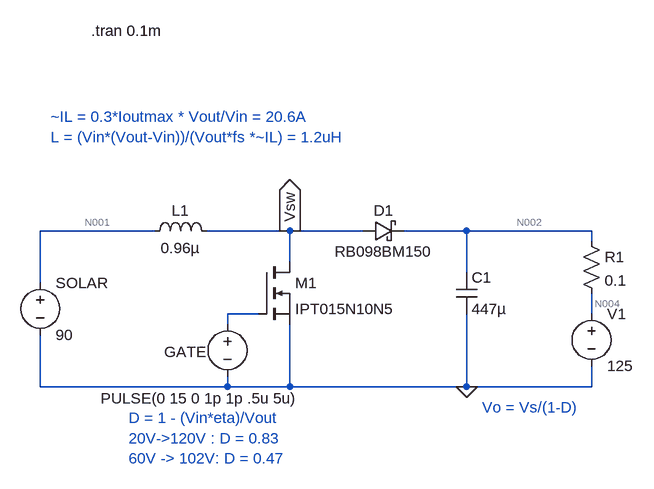
[diagram p0: schematic boost_conv.asc]
boost_conv.asc, the LTspice schematic file:
Version 4
SHEET 1 1992 680
WIRE 192 48 16 48
WIRE 400 48 272 48
WIRE 512 48 400 48
WIRE 672 48 576 48
WIRE 864 48 672 48
WIRE 864 64 864 48
WIRE 400 96 400 48
WIRE 672 112 672 48
WIRE 16 128 16 48
WIRE 352 176 304 176
WIRE 864 176 864 144
WIRE 304 192 304 176
WIRE 16 288 16 208
WIRE 304 288 304 272
WIRE 304 288 16 288
WIRE 400 288 400 192
WIRE 400 288 304 288
WIRE 672 288 672 176
WIRE 672 288 400 288
WIRE 864 288 864 256
WIRE 864 288 672 288
FLAG 400 48 Vsw
IOPIN 400 48 Out
FLAG 672 288 0
SYMBOL voltage 16 112 R0
SYMATTR InstName SOLAR
SYMATTR Value 90
SYMBOL ind 176 64 R270
WINDOW 0 32 56 VTop 2
WINDOW 3 5 56 VBottom 2
SYMATTR InstName L1
SYMATTR Value 0.96µ
SYMBOL nmos 352 96 R0
SYMATTR InstName M1
SYMATTR Value IPT015N10N5
SYMBOL voltage 304 176 R0
WINDOW 0 -97 58 Left 2
WINDOW 3 109 130 Right 2
WINDOW 123 0 0 Left 0
WINDOW 39 0 0 Left 0
SYMATTR InstName GATE
SYMATTR Value PULSE(0 15 0 1p 1p .5u 5u)
SYMBOL schottky 512 64 R270
WINDOW 0 32 32 VTop 2
WINDOW 3 0 32 VBottom 2
SYMATTR InstName D1
SYMATTR Value RB098BM150
SYMATTR Description Diode
SYMATTR Type diode
SYMBOL cap 656 112 R0
SYMATTR InstName C1
SYMATTR Value 447µ
SYMBOL voltage 864 160 R0
WINDOW 123 0 0 Left 0
WINDOW 39 0 0 Left 0
SYMATTR InstName V1
SYMATTR Value 125
SYMBOL res 848 48 R0
SYMATTR InstName R1
SYMATTR Value 0.1
TEXT 696 320 Left 2 ;Vo = Vs/(1-D)
TEXT 32 -128 Left 2 ;~IL = 0.3*Ioutmax * Vout/Vin = 20.6A\nL = (Vin*(Vout-Vin))/(Vout*fs *~IL) = 1.2uH
TEXT 152 336 Left 2 ;D = 1 - (Vin*eta)/Vout\n20V->120V : D = 0.83\n60V -> 102V: D = 0.47
TEXT 94 -260 Left 2 !.tran 0.1m

The netlist it stands for:
* boost_conv.asc
V§SOLAR N001 0 90
L1 N001 Vsw 0.96µ
M1 Vsw N003 0 0 IPT015N10N5
V§GATE N003 0 PULSE(0 15 0 1p 1p .5u 5u)
D1 Vsw N002 RB098BM150
C1 N002 0 447µ
V1 N004 0 125
R1 N002 N004 0.1
.model D D
.lib standard.dio
.model NMOS NMOS
.model PMOS PMOS
.lib standard.mos
* Vo = Vs/(1-D)
* ~IL = 0.3*Ioutmax * Vout/Vin = 20.6A
* L = (Vin*(Vout-Vin))/(Vout*fs *~IL) = 1.2uH
* D = 1 - (Vin*eta)/Vout
* 20V->120V : D = 0.83
* 60V -> 102V: D = 0.47
.tran 0.1m
.backanno
.end

* Results of the author's LTspice run, read from the files saved beside the schematic
* Operating Point, zero values left out:
*   V(n001) = 90 V
*   V(vsw) = 90 V
*   V(n002) = 125 V
*   V(n004) = 125 V
*   Id(M1) = 142.1 pA
*   Is(M1) = -142.1 pA
*   I(D1) = -124.2 nA
*   I(L1) = -123.9 nA
*   I(R1) = -124.2 nA
*   I(V1) = -124.2 nA
*   I(Solar) = 123.9 nA